# Altium schematic sheet 4_Unextended_Standard_periferals.SchDoc: =ProjectTitle
size A4; Address1: github.com/4pplet/Unextended; Address2: Licence: CERN-OHL-S; SheetNumber: 4; SheetTotal: 4
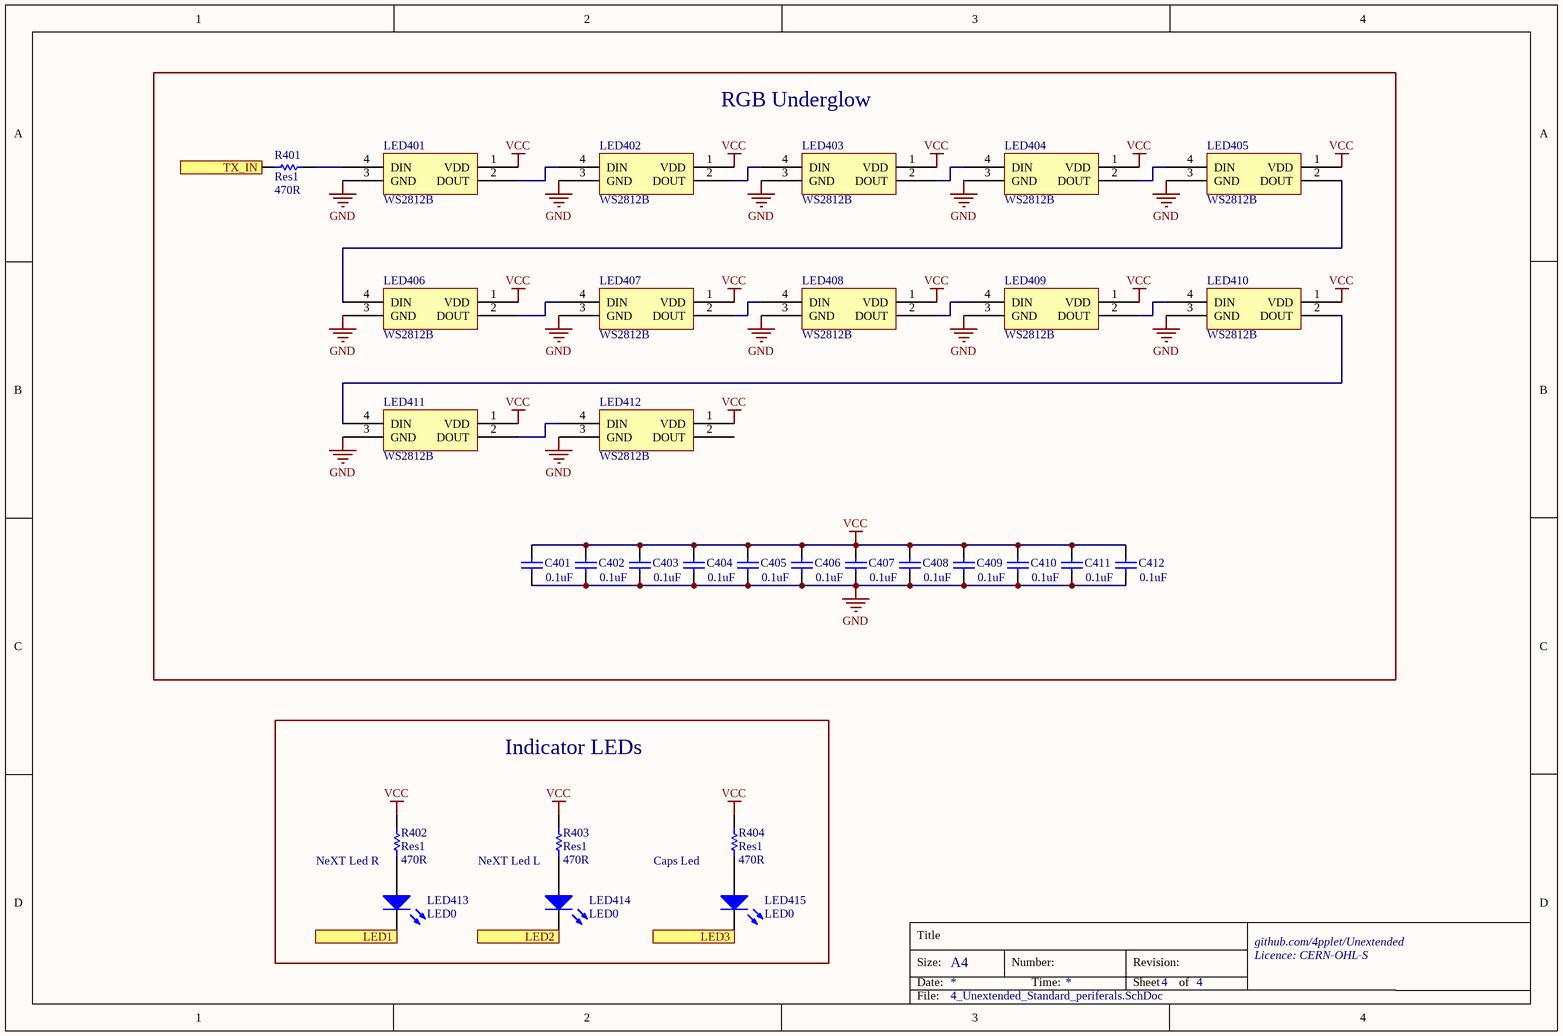
[diagram p0: 4_Unextended_Standard_periferals.SchDoc]

## Parts
C401  value 0.1uF  [C0603[1608]]
C402  value 0.1uF  [C0603[1608]]
C403  value 0.1uF  [C0603[1608]]
C404  value 0.1uF  [C0603[1608]]
C405  value 0.1uF  [C0603[1608]]
C406  value 0.1uF  [C0603[1608]]
C407  value 0.1uF  [C0603[1608]]
C408  value 0.1uF  [C0603[1608]]
C409  value 0.1uF  [C0603[1608]]
C410  value 0.1uF  [C0603[1608]]
C411  value 0.1uF  [C0603[1608]]
C412  value 0.1uF  [C0603[1608]]
LED401  WS2812B  [WS2812B - 5050]
LED402  WS2812B  [WS2812B - 5050]
LED403  WS2812B  [WS2812B - 5050]
LED404  WS2812B  [WS2812B - 5050]
LED405  WS2812B  [WS2812B - 5050]
LED406  WS2812B  [WS2812B - 5050]
LED407  WS2812B  [WS2812B - 5050]
LED408  WS2812B  [WS2812B - 5050]
LED409  WS2812B  [WS2812B - 5050]
LED410  WS2812B  [WS2812B - 5050]
LED411  WS2812B  [WS2812B - 5050]
LED412  WS2812B  [WS2812B - 5050]
LED413  LED0  [SWITCH_LED - 1U]  (no BOM)
LED414  LED0  [SWITCH_LED - 1U]  (no BOM)
LED415  LED0  [SWITCH_LED - 1U]  (no BOM)
R401  Res1  value 470R  [R0603[1608]]
R402  Res1  value 470R  [R0603[1608]]
R403  Res1  value 470R  [R0603[1608]]
R404  Res1  value 470R  [R0603[1608]]

## Blocks framed on the sheet
RGB Underglow: C401-C412 LED401-LED412 R401
Indicator LEDs: LED413-LED415 R402-R404

## Ports
LED1, LED2, LED3, TX_IN

## Nets
GND: C401.1 C402.1 C403.1 C404.1 C405.1 C406.1 C407.1 C408.1 C409.1 C410.1 C411.1 C412.1 LED401.3(GND) LED402.3(GND) LED403.3(GND) LED404.3(GND) LED405.3(GND) LED406.3(GND) LED407.3(GND) LED408.3(GND) LED409.3(GND) LED410.3(GND) LED411.3(GND) LED412.3(GND)
VCC: C401.2 C402.2 C403.2 C404.2 C405.2 C406.2 C407.2 C408.2 C409.2 C410.2 C411.2 C412.2 LED401.1(VDD) LED402.1(VDD) LED403.1(VDD) LED404.1(VDD) LED405.1(VDD) LED406.1(VDD) LED407.1(VDD) LED408.1(VDD) LED409.1(VDD) LED410.1(VDD) LED411.1(VDD) LED412.1(VDD) R402.2 R403.2 R404.2
LED1: LED413.2(K) ; port LED1
LED2: LED414.2(K) ; port LED2
LED3: LED415.2(K) ; port LED3
TX_IN: R401.1 ; port TX_IN
NetLED401_2: LED401.2(DOUT) LED402.4(DIN)
NetLED401_4: LED401.4(DIN) R401.2
NetLED402_2: LED402.2(DOUT) LED403.4(DIN)
NetLED403_2: LED403.2(DOUT) LED404.4(DIN)
NetLED404_2: LED404.2(DOUT) LED405.4(DIN)
NetLED405_2: LED405.2(DOUT) LED406.4(DIN)
NetLED406_2: LED406.2(DOUT) LED407.4(DIN)
NetLED407_2: LED407.2(DOUT) LED408.4(DIN)
NetLED408_2: LED408.2(DOUT) LED409.4(DIN)
NetLED409_2: LED409.2(DOUT) LED410.4(DIN)
NetLED410_2: LED410.2(DOUT) LED411.4(DIN)
NetLED411_2: LED411.2(DOUT) LED412.4(DIN)
NetLED413_1: LED413.1(A) R402.1
NetLED414_1: LED414.1(A) R403.1
NetLED415_1: LED415.1(A) R404.1

Not connected (* = marked no-connect by the designer): LED412 2(DOUT)

## Notes on the sheet
- NeXT Led R
- NeXT Led L
- Caps Led
- Title
- Size:
- Date:
- A4
- Number:
- Time:
- Revision:
- Sheet
- of
- File:

## Library data of the parts
C401-C412 = Cap: Capacitor; MRF.Part: CC0603KRX7R9BB104; LCSC MFG: YAGEO; Version: 0603 imperial; LCSC Part #: C14663
LED401-LED412 = WS2812B: MRF.Part: WS2812E-V5; LCSC MFG: Worldsemi; LCSC Part #: C2920042
LED413-LED415 = LED0: Typical INFRARED GaAs LED
R401-R404 = Res1: Resistor; MRF.Part: 0603WAF4700T5E; LCSC MFG: UNI-ROYAL(Uniroyal Elec); Version: 0603 imperial; LCSC Part #: C23179